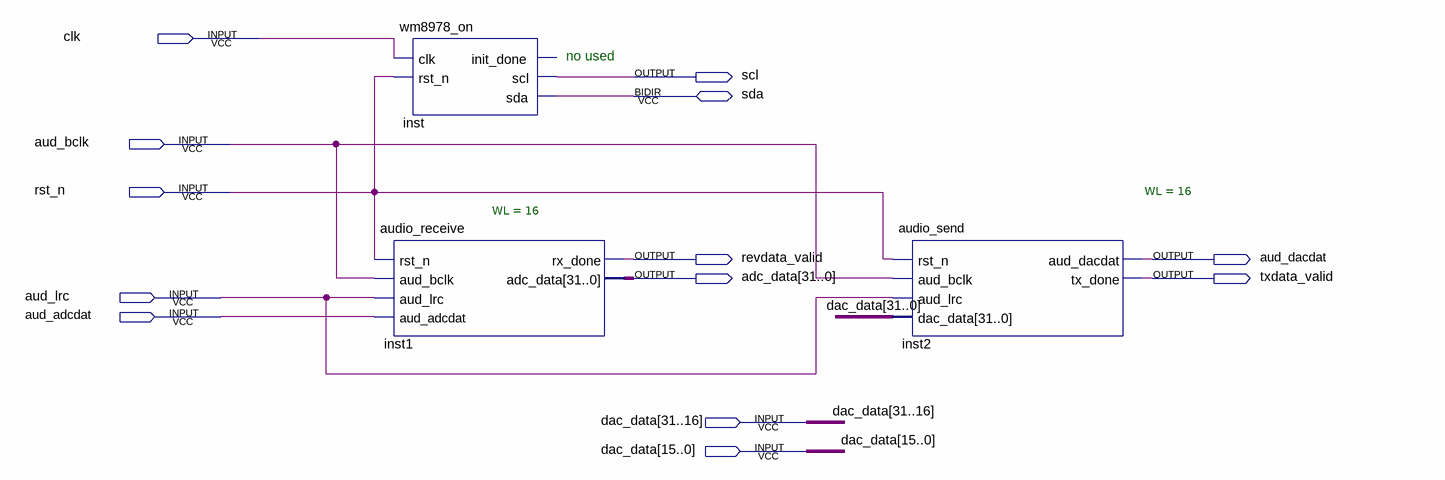
[diagram p0: schematic sheet]
// Quartus schematic wm8978_top.bdf as structural Verilog: 3 symbols, 13 pins
module wm8978_top (
  input  clk,
  input  aud_bclk,
  input  rst_n,
  input  aud_lrc,
  input  aud_adcdat,
  input  [31:0] dac_data,
  inout  sda,
  output scl,
  output revdata_valid,
  output aud_dacdat,
  output [31:0] adc_data,
  output txdata_valid
);

  wm8978_on inst (.clk(clk), .rst_n(rst_n), .scl(scl), .sda(sda));  // open: init_done
  audio_receive #(.WL(16)) inst1 (
    .rst_n(rst_n), .aud_bclk(aud_bclk), .aud_lrc(aud_lrc), .aud_adcdat(aud_adcdat), .rx_done(revdata_valid),
    .adc_data(adc_data));
  audio_send #(.WL(16)) inst2 (
    .rst_n(rst_n), .aud_bclk(aud_bclk), .aud_lrc(aud_lrc), .dac_data(dac_data), .aud_dacdat(aud_dacdat),
    .tx_done(txdata_valid));

  // Notes on the sheet:
  //   no used
endmodule
